# Altium schematic sheet IO.SchDoc
size A3; Organization: Miltera; Address1: Bilişim Vadisi Muallim Mah.; Address2: Deniz Cad.; Address3: No:143/5 A7 Blok; Address4: Kat:2 Kapı No:35; SheetNumber: 5; SheetTotal: 7
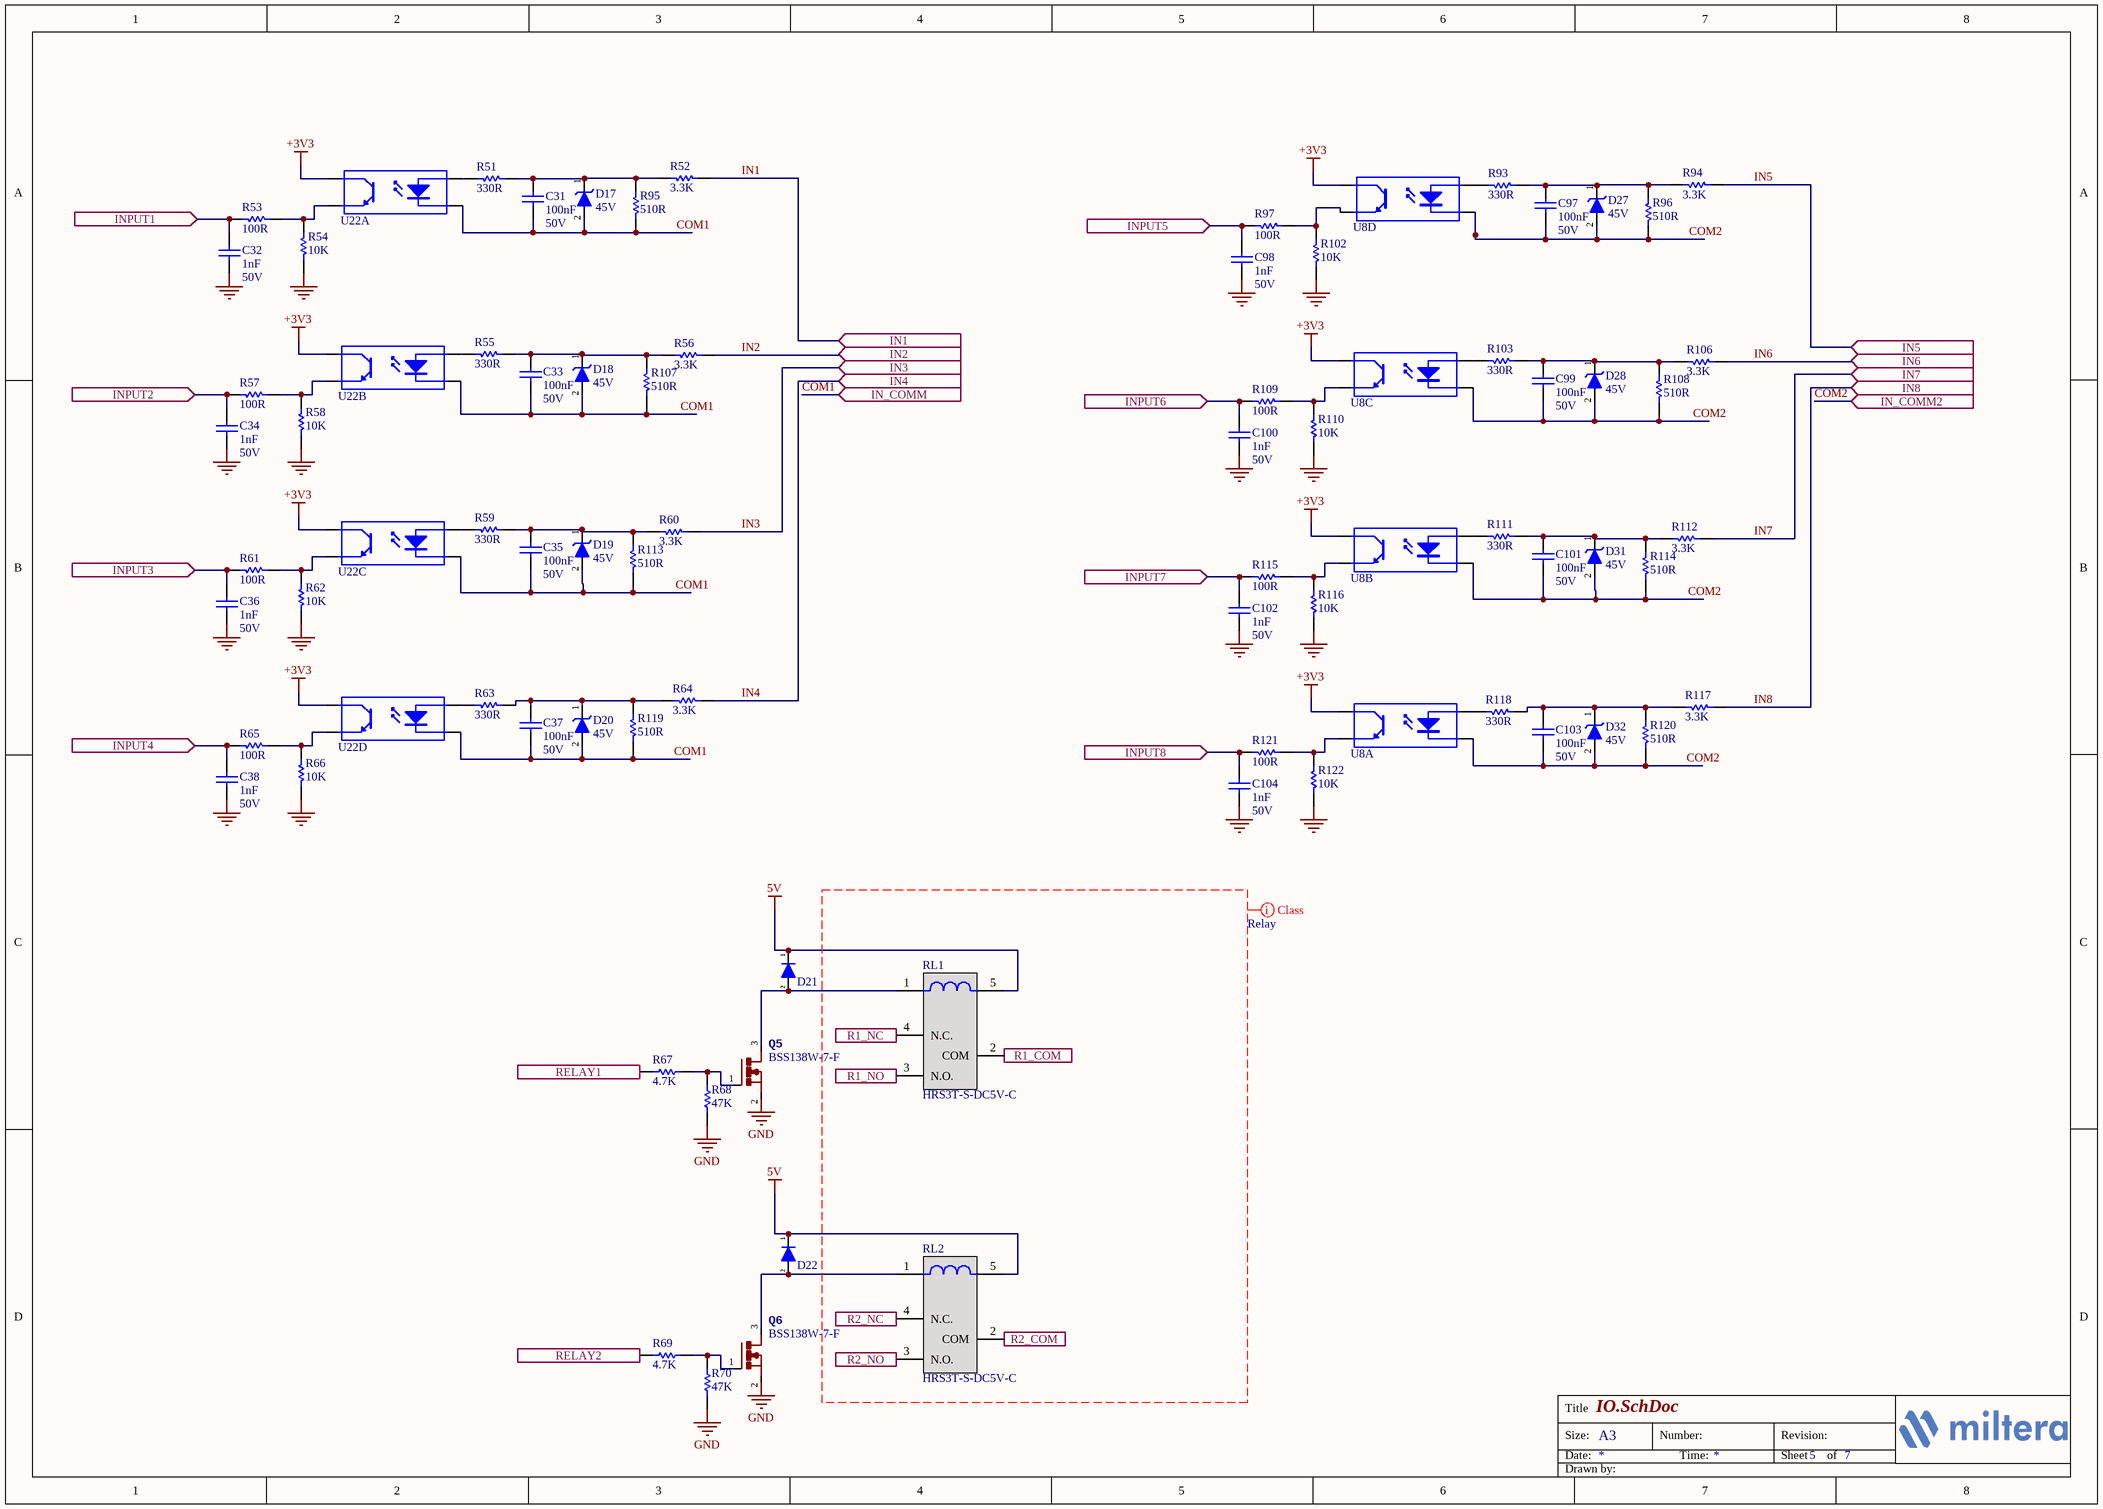
[diagram p0: IO.SchDoc]

## Parts
C31  value 100nF  Voltage: 50V  [CAP_0603]  (hidden comment: CAP)
C32  value 1nF  Voltage: 50V  [CAP_0603]  (hidden comment: CAP)
C33  value 100nF  Voltage: 50V  [CAP_0603]  (hidden comment: CAP)
C34  value 1nF  Voltage: 50V  [CAP_0603]  (hidden comment: CAP)
C35  value 100nF  Voltage: 50V  [CAP_0603]  (hidden comment: CAP)
C36  value 1nF  Voltage: 50V  [CAP_0603]  (hidden comment: CAP)
C37  value 100nF  Voltage: 50V  [CAP_0603]  (hidden comment: CAP)
C38  value 1nF  Voltage: 50V  [CAP_0603]  (hidden comment: CAP)
C97  value 100nF  Voltage: 50V  [CAP_0603]  (hidden comment: CAP)
C98  value 1nF  Voltage: 50V  [CAP_0603]  (hidden comment: CAP)
C99  value 100nF  Voltage: 50V  [CAP_0603]  (hidden comment: CAP)
C100  value 1nF  Voltage: 50V  [CAP_0603]  (hidden comment: CAP)
C101  value 100nF  Voltage: 50V  [CAP_0603]  (hidden comment: CAP)
C102  value 1nF  Voltage: 50V  [CAP_0603]  (hidden comment: CAP)
C103  value 100nF  Voltage: 50V  [CAP_0603]  (hidden comment: CAP)
C104  value 1nF  Voltage: 50V  [CAP_0603]  (hidden comment: CAP)
D17  45V  [sod123w]
D18  45V  [sod123w]
D19  45V  [sod123w]
D20  45V  [sod123w]
D21  Diode-SMA  [SOD-123]  (value not drawn)
D22  Diode-SMA  [SOD-123]  (value not drawn)
D27  45V  [sod123w]
D28  45V  [sod123w]
D31  45V  [sod123w]
D32  45V  [sod123w]
Q5  Manufacturer Part Number: BSS138W-7-F  [SOT323]  (hidden comment: MOSFET_N_GSD)
Q6  Manufacturer Part Number: BSS138W-7-F  [SOT323]  (hidden comment: MOSFET_N_GSD)
R51  value 330R  [RES_0603]  (hidden comment: RES)
R52  value 3.3K  [R1206]  (hidden comment: RES)
R53  value 100R  [RES_0603]  (hidden comment: RES)
R54  value 10K  [RES_0603]  (hidden comment: RES)
R55  value 330R  [RES_0603]  (hidden comment: RES)
R56  value 3.3K  [R1206]  (hidden comment: RES)
R57  value 100R  [RES_0603]  (hidden comment: RES)
R58  value 10K  [RES_0603]  (hidden comment: RES)
R59  value 330R  [RES_0603]  (hidden comment: RES)
R60  value 3.3K  [R1206]  (hidden comment: RES)
R61  value 100R  [RES_0603]  (hidden comment: RES)
R62  value 10K  [RES_0603]  (hidden comment: RES)
R63  value 330R  [RES_0603]  (hidden comment: RES)
R64  value 3.3K  [R1206]  (hidden comment: RES)
R65  value 100R  [RES_0603]  (hidden comment: RES)
R66  value 10K  [RES_0603]  (hidden comment: RES)
R67  value 4.7K  [RES_0603]  (hidden comment: RES)
R68  value 47K  [RES_0603]  (hidden comment: RES)
R69  value 4.7K  [RES_0603]  (hidden comment: RES)
R70  value 47K  [RES_0603]  (hidden comment: RES)
R93  value 330R  [RES_0603]  (hidden comment: RES)
R94  value 3.3K  [R1206]  (hidden comment: RES)
R95  value 510R  [R0603]  (hidden comment: 0603SAJ0511T5E)
R96  value 510R  [R0603]  (hidden comment: 0603SAJ0511T5E)
R97  value 100R  [RES_0603]  (hidden comment: RES)
R102  value 10K  [RES_0603]  (hidden comment: RES)
R103  value 330R  [RES_0603]  (hidden comment: RES)
R106  value 3.3K  [R1206]  (hidden comment: RES)
R107  value 510R  [R0603]  (hidden comment: 0603SAJ0511T5E)
R108  value 510R  [R0603]  (hidden comment: 0603SAJ0511T5E)
R109  value 100R  [RES_0603]  (hidden comment: RES)
R110  value 10K  [RES_0603]  (hidden comment: RES)
R111  value 330R  [RES_0603]  (hidden comment: RES)
R112  value 3.3K  [R1206]  (hidden comment: RES)
R113  value 510R  [R0603]  (hidden comment: 0603SAJ0511T5E)
R114  value 510R  [R0603]  (hidden comment: 0603SAJ0511T5E)
R115  value 100R  [RES_0603]  (hidden comment: RES)
R116  value 10K  [RES_0603]  (hidden comment: RES)
R117  value 3.3K  [R1206]  (hidden comment: RES)
R118  value 330R  [RES_0603]  (hidden comment: RES)
R119  value 510R  [R0603]  (hidden comment: 0603SAJ0511T5E)
R120  value 510R  [R0603]  (hidden comment: 0603SAJ0511T5E)
R121  value 100R  [RES_0603]  (hidden comment: RES)
R122  value 10K  [RES_0603]  (hidden comment: RES)
RL1  HRS3T-S-DC5V-C  [JQ15VF]
RL2  HRS3T-S-DC5V-C  [JQ15VF]
U8  SFH6916  [SOIC-16]  (value not drawn)  (parts A,B,C,D of 4)
U22  SFH6916  [SOIC-16]  (value not drawn)  (parts A,B,C,D of 4)

## Ports
IN1 (in), IN2 (in), IN3 (in), IN4 (in), IN5 (in), IN6 (in), IN7 (in), IN8 (in), IN_COMM2 (in), IN_COMM (in), INPUT1 (in), INPUT2 (in), INPUT3 (in), INPUT4 (in), INPUT5 (in), INPUT6 (in), INPUT7 (in), INPUT8 (in), R1_COM (in), R1_NC (in), R1_NO (in), R2_COM (in), R2_NC (in), R2_NO (in), RELAY1 (in), RELAY2 (in)

## Nets
5V: D21.1 D22.1 RL1.5(COIL_2) RL2.5(COIL_2)
+3V3: U8.10(C) U8.12(C) U8.14(C) U8.16(C) U22.10(C) U22.12(C) U22.14(C) U22.16(C)
GND: C32.2 C34.2 C36.2 C38.2 C98.2 C100.2 C102.2 C104.2 Q5.2(S) Q6.2(S) R54.2 R58.2 R62.2 R66.2 R68.2 R70.2 R102.2 R110.2 R116.2 R122.2
COM1: C31.2 C33.2 C35.2 C37.2 D17.2(A) D18.2(A) D19.2(A) D20.2(A) R95.1 R107.1 R113.1 R119.1 U22.2(K) U22.4(K) U22.6(K) U22.8(K) ; port IN_COMM
COM2: C97.2 C99.2 C101.2 C103.2 D27.2(A) D28.2(A) D31.2(A) D32.2(A) R96.1 R108.1 R114.1 R120.1 U8.2(K) U8.4(K) U8.6(K) U8.8(K) ; port IN_COMM2
IN1: R52.2 ; port IN1
IN2: R56.2 ; port IN2
IN3: R60.2 ; port IN3
IN4: R64.2 ; port IN4
IN5: R94.2 ; port IN5
IN6: R106.2 ; port IN6
IN7: R112.2 ; port IN7
IN8: R117.2 ; port IN8
INPUT1: C32.1 R53.2 ; port INPUT1
INPUT2: C34.1 R57.2 ; port INPUT2
INPUT3: C36.1 R61.2 ; port INPUT3
INPUT4: C38.1 R65.2 ; port INPUT4
INPUT5: C98.1 R97.2 ; port INPUT5
INPUT6: C100.1 R109.2 ; port INPUT6
INPUT7: C102.1 R115.2 ; port INPUT7
INPUT8: C104.1 R121.2 ; port INPUT8
R1_COM: RL1.2(COM) ; port R1_COM
R1_NC: RL1.4(N.C.) ; port R1_NC
R1_NO: RL1.3(N.O.) ; port R1_NO
R2_COM: RL2.2(COM) ; port R2_COM
R2_NC: RL2.4(N.C.) ; port R2_NC
R2_NO: RL2.3(N.O.) ; port R2_NO
RELAY1: R67.1 ; port RELAY1
RELAY2: R69.1 ; port RELAY2
NetC31_1: C31.1 D17.1(K) R51.1 R52.1 R95.2
NetC33_1: C33.1 D18.1(K) R55.1 R56.1 R107.2
NetC35_1: C35.1 D19.1(K) R59.1 R60.1 R113.2
NetC37_1: C37.1 D20.1(K) R63.1 R64.1 R119.2
NetC97_1: C97.1 D27.1(K) R93.1 R94.1 R96.2
NetC99_1: C99.1 D28.1(K) R103.1 R106.1 R108.2
NetC101_1: C101.1 D31.1(K) R111.1 R112.1 R114.2
NetC103_1: C103.1 D32.1(K) R117.1 R118.1 R120.2
NetD21_2: D21.2 Q5.3(D) RL1.1(COIL_1)
NetD22_2: D22.2 Q6.3(D) RL2.1(COIL_1)
NetQ5_1: Q5.1(G) R67.2 R68.1
NetQ6_1: Q6.1(G) R69.2 R70.1
NetR51_2: R51.2 U22.1(A)
NetR53_1: R53.1 R54.1 U22.15(E)
NetR55_2: R55.2 U22.3(A)
NetR57_1: R57.1 R58.1 U22.13(E)
NetR59_2: R59.2 U22.5(A)
NetR61_1: R61.1 R62.1 U22.11(E)
NetR63_2: R63.2 U22.7(A)
NetR65_1: R65.1 R66.1 U22.9(E)
NetR93_2: R93.2 U8.7(A)
NetR97_1: R97.1 R102.1 U8.9(E)
NetR103_2: R103.2 U8.5(A)
NetR109_1: R109.1 R110.1 U8.11(E)
NetR111_2: R111.2 U8.3(A)
NetR115_1: R115.1 R116.1 U8.13(E)
NetR118_2: R118.2 U8.1(A)
NetR121_1: R121.1 R122.1 U8.15(E)

## Layout directives
net class Relay: (no net found under the mark)

## Notes on the sheet
- Title
- Size:
- Date:
- A3
- Number:
- Time:
- Revision:
- Sheet
- of
- Drawn by:

## Library data of the parts
C31 C33 C35 C37 C97 C99 C101 C103 = C01763: CAP CER 100nF 50VDC %10 X7R SMD; Manufacturer: Samsung; Manufacturer Part Number: CL10B104KB8NNNL
C32 C34 C36 C38 C98 C100 C102 C104 = C01779: CAP CER 1nF 50VDC %10 X7R SMD; Manufacturer: Samsung; Manufacturer Part Number: CL10B102KB8NNNL
D17-D20 D27 D28 D31 D32 = DIO00040: TVS DIODE 26VWM 42.1VC SOD123W; Manufacturer Part Number: PTVS26VS1UR,115; Manufacturer: Nexperia USA Inc.
D21 D22 = DIO00030: DIODE SCHOTTKY 350MA 40V SOD123; Manufacturer Part Number: SD103AW-HT; Manufacturer: HOTTECH
Q5 Q6 = Q_DIO_BSS138W-7-F: MOSFET N-CH 50V 200MA SC70-3; Manufacturer: Diodes Incorporated
R51 R55 R59 R63 R93 R103 R111 R118 = R03005: RES 0603 330 Ohms 1% 1/10W-S 100PPM; Manufacturer: ROYALOHM; Manufacturer Part Number: 0603SAF3300T5E
R52 R56 R60 R64 R94 R106 R112 R117 = R03046: RES.(3216) 1206 3.3K Ohms 1% 1/4W-S 100PPM; Manufacturer: ROYALOHM; Manufacturer Part Number: 1206S4F3301T5E
R53 R57 R61 R65 R97 R109 R115 R121 = R03028: RES 0603 100 Ohms 1% 1/10W-S 100PPM; Manufacturer: ROYALOHM; Manufacturer Part Number: 0603SAF1000T5E
R54 R58 R62 R66 R102 R110 R116 R122 = R02995: RES 0603 10k Ohms %1 1/10W 100PPM; Manufacturer: ROYALOHM; Manufacturer Part Number: 0603SAF1002T5E
R67 R69 = R02994: RES 0603 4.7k Ohms %1 1/10W 100PPM; Manufacturer: ROYALOHM; Manufacturer Part Number: 0603SAF4701T5E
R68 R70 = R03000: RES 0603 47K Ohms 1% 1/10W-S 100PPM; Manufacturer: ROYALOHM; Manufacturer Part Number: 0603SAF4702T5E
R95 R96 R107 R108 R113 R114 R119 R120 = R03005: RES.(1608) 0603 510 Ohms 5% 1/10W-S 100PPM; Manufacturer: ROYALOHM; Manufacturer Part Number: 0603SAJ0511T5E
RL1 RL2 = HRS3T-S-DC5V-C: RELAY POWER 10A 5VDC 1FormC HKE; Manufacturer: HKE; Manufacturer Part Number: HRS3T-S-DC5V-C
U8 U22 = SFH6916: OPTOISOLATOR TRANSISTOR OUTPUT 3.75KV 4CH SOP-16; Manufacturer: VISHAY; Manufacturer Part Number: SFH6916